# Altium schematic sheet Dynamixel Power.SchDoc
size A4
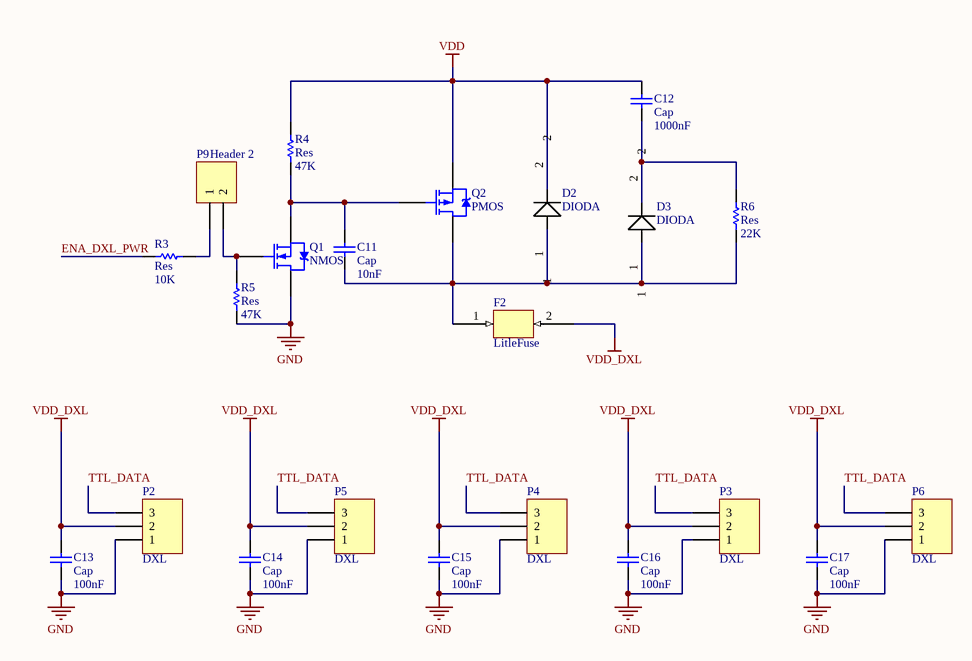
[diagram p0: Dynamixel Power.SchDoc]

## Parts
C11  Cap  value 10nF  [0603-CAP]
C12  Cap  value 1000nF  [0603-CAP]
C13  Cap  value 100nF  [0603-CAP]
C14  Cap  value 100nF  [0603-CAP]
C15  Cap  value 100nF  [0603-CAP]
C16  Cap  value 100nF  [0603-CAP]
C17  Cap  value 100nF  [0603-CAP]
D2  DIODA  [DIODE SS14 SODFL]
D3  DIODA  [DIODE SS14 SODFL]
F2  LitleFuse  [LitleFuse]
P2  DXL  [DXL]
P3  DXL  [DXL]
P4  DXL  [DXL]
P5  DXL  [DXL]
P6  DXL  [DXL]
P9  Header 2  [HDR1X2]
Q1  NMOS  [SOT23]
Q2  PMOS  [TO263]
R3  Res  value 10K  [0603-RES]
R4  Res  value 47K  [0603-RES]
R5  Res  value 47K  [0603-RES]
R6  Res  value 22K  [0603-RES]

## Nets
GND: C13.1 C14.1 C15.1 C16.1 C17.1 P2.1 P3.1 P4.1 P5.1 P6.1 Q1.3(D) R5.1
VDD: C12.2 D2.2 Q2.2(S) R4.2
VDD_DXL: C13.2 C14.2 C15.2 C16.2 C17.2 F2.2 P2.2 P3.2 P4.2 P5.2 P6.2
ENA_DXL_PWR: R3.1
TTL_DATA: P2.3 P3.3 P4.3 P5.3 P6.3
NetC11_1: C11.1 D2.1 D3.1 F2.1 Q2.3(D) R6.1
NetC11_2: C11.2 Q1.2(S) Q2.1(G) R4.1
NetC12_1: C12.1 D3.2 R6.2
NetP9_1: P9.1 R3.2
NetP9_2: P9.2 Q1.1(G) R5.2

## Library data of the parts
C11-C17 = Cap: Capacitor; Published: 8-Jun-2000; LatestRevisionDate: 17-Jul-2002; LatestRevisionNote: Re-released for DXP Platform.; PackageReference: RAD-0.3; Publisher: Altium Limited; PackageDescription: Radial Cap, Thru-Hole; 2 Leads; 0.3 in Pin Spacing
P9 = Header 2: Header, 2-Pin; LatestRevisionDate: 17-Jul-2002; LatestRevisionNote: Re-released for DXP Platform.; Publisher: Altium Limited
Q1 = NMOS: N-Channel Power MOSFET; Note: Pin 2 is electrically connected to pin 4.; Published: 8-Jun-2000; LatestRevisionDate: 17-Jul-2002; LatestRevisionNote: Re-released for DXP Platform.; DatasheetVersion: PD-9.814; PackageVersion: Feb-1997; PackageReference: TO-220AB; Publisher: Altium Limited; PackageDescription: TO, Thru-Hole, Vertical, Heatsink Mounted; 3 In-Line Leads; Pitch 2.54 mm; ComponentLink1Description: Manufacturer Link; ComponentLink1URL: http://www.irf.com/
Q2 = PMOS: P-Channel Power MOSFET; Note: Pin 4 not drawn and electrically connected to Pin 2.; Published: 8-Jun-2000; LatestRevisionDate: 17-Jul-2002; LatestRevisionNote: Re-released for DXP Platform.; DatasheetVersion: PD-9.390D; PackageVersion: Feb-1997; PackageReference: TO-220AB; Publisher: Altium Limited; PackageDescription: TO, Thru-Hole, Vertical, Heatsink Mounted; 3 In-Line Leads; Pitch 2.54 mm; ComponentLink1Description: Manufacturer Link; ComponentLink1URL: http://www.irf.com/
R3-R6 = Res: Resistor; Published: 8-Jun-2000; LatestRevisionDate: 17-Jul-2002; LatestRevisionNote: Re-released for DXP Platform.; PackageReference: AXIAL-0.3; Publisher: Altium Limited; PackageDescription: Axial Device, Thru-Hole; 2 Leads; 0.3 in Pin Spacing